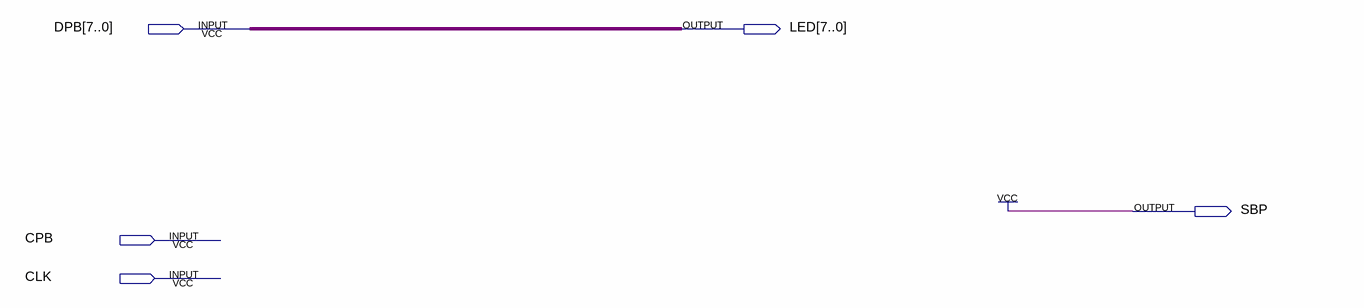
[diagram p0: schematic sheet]
// Quartus schematic UB.bdf as structural Verilog: 0 symbols, 5 pins
module UB (
  input  [7:0] DPB,
  input  CPB,
  input  CLK,
  output [7:0] LED,
  output SBP
);


  assign LED = DPB;
  assign SBP = 1'b1;
endmodule
